# EasyEDA schematic SCH_HackerCard.json
TITLE: Sheet_1; REV: 1.0; Date: 2024-08-17; Sheet: 1/1; Drawn By: linuxdino; Company: Your Company
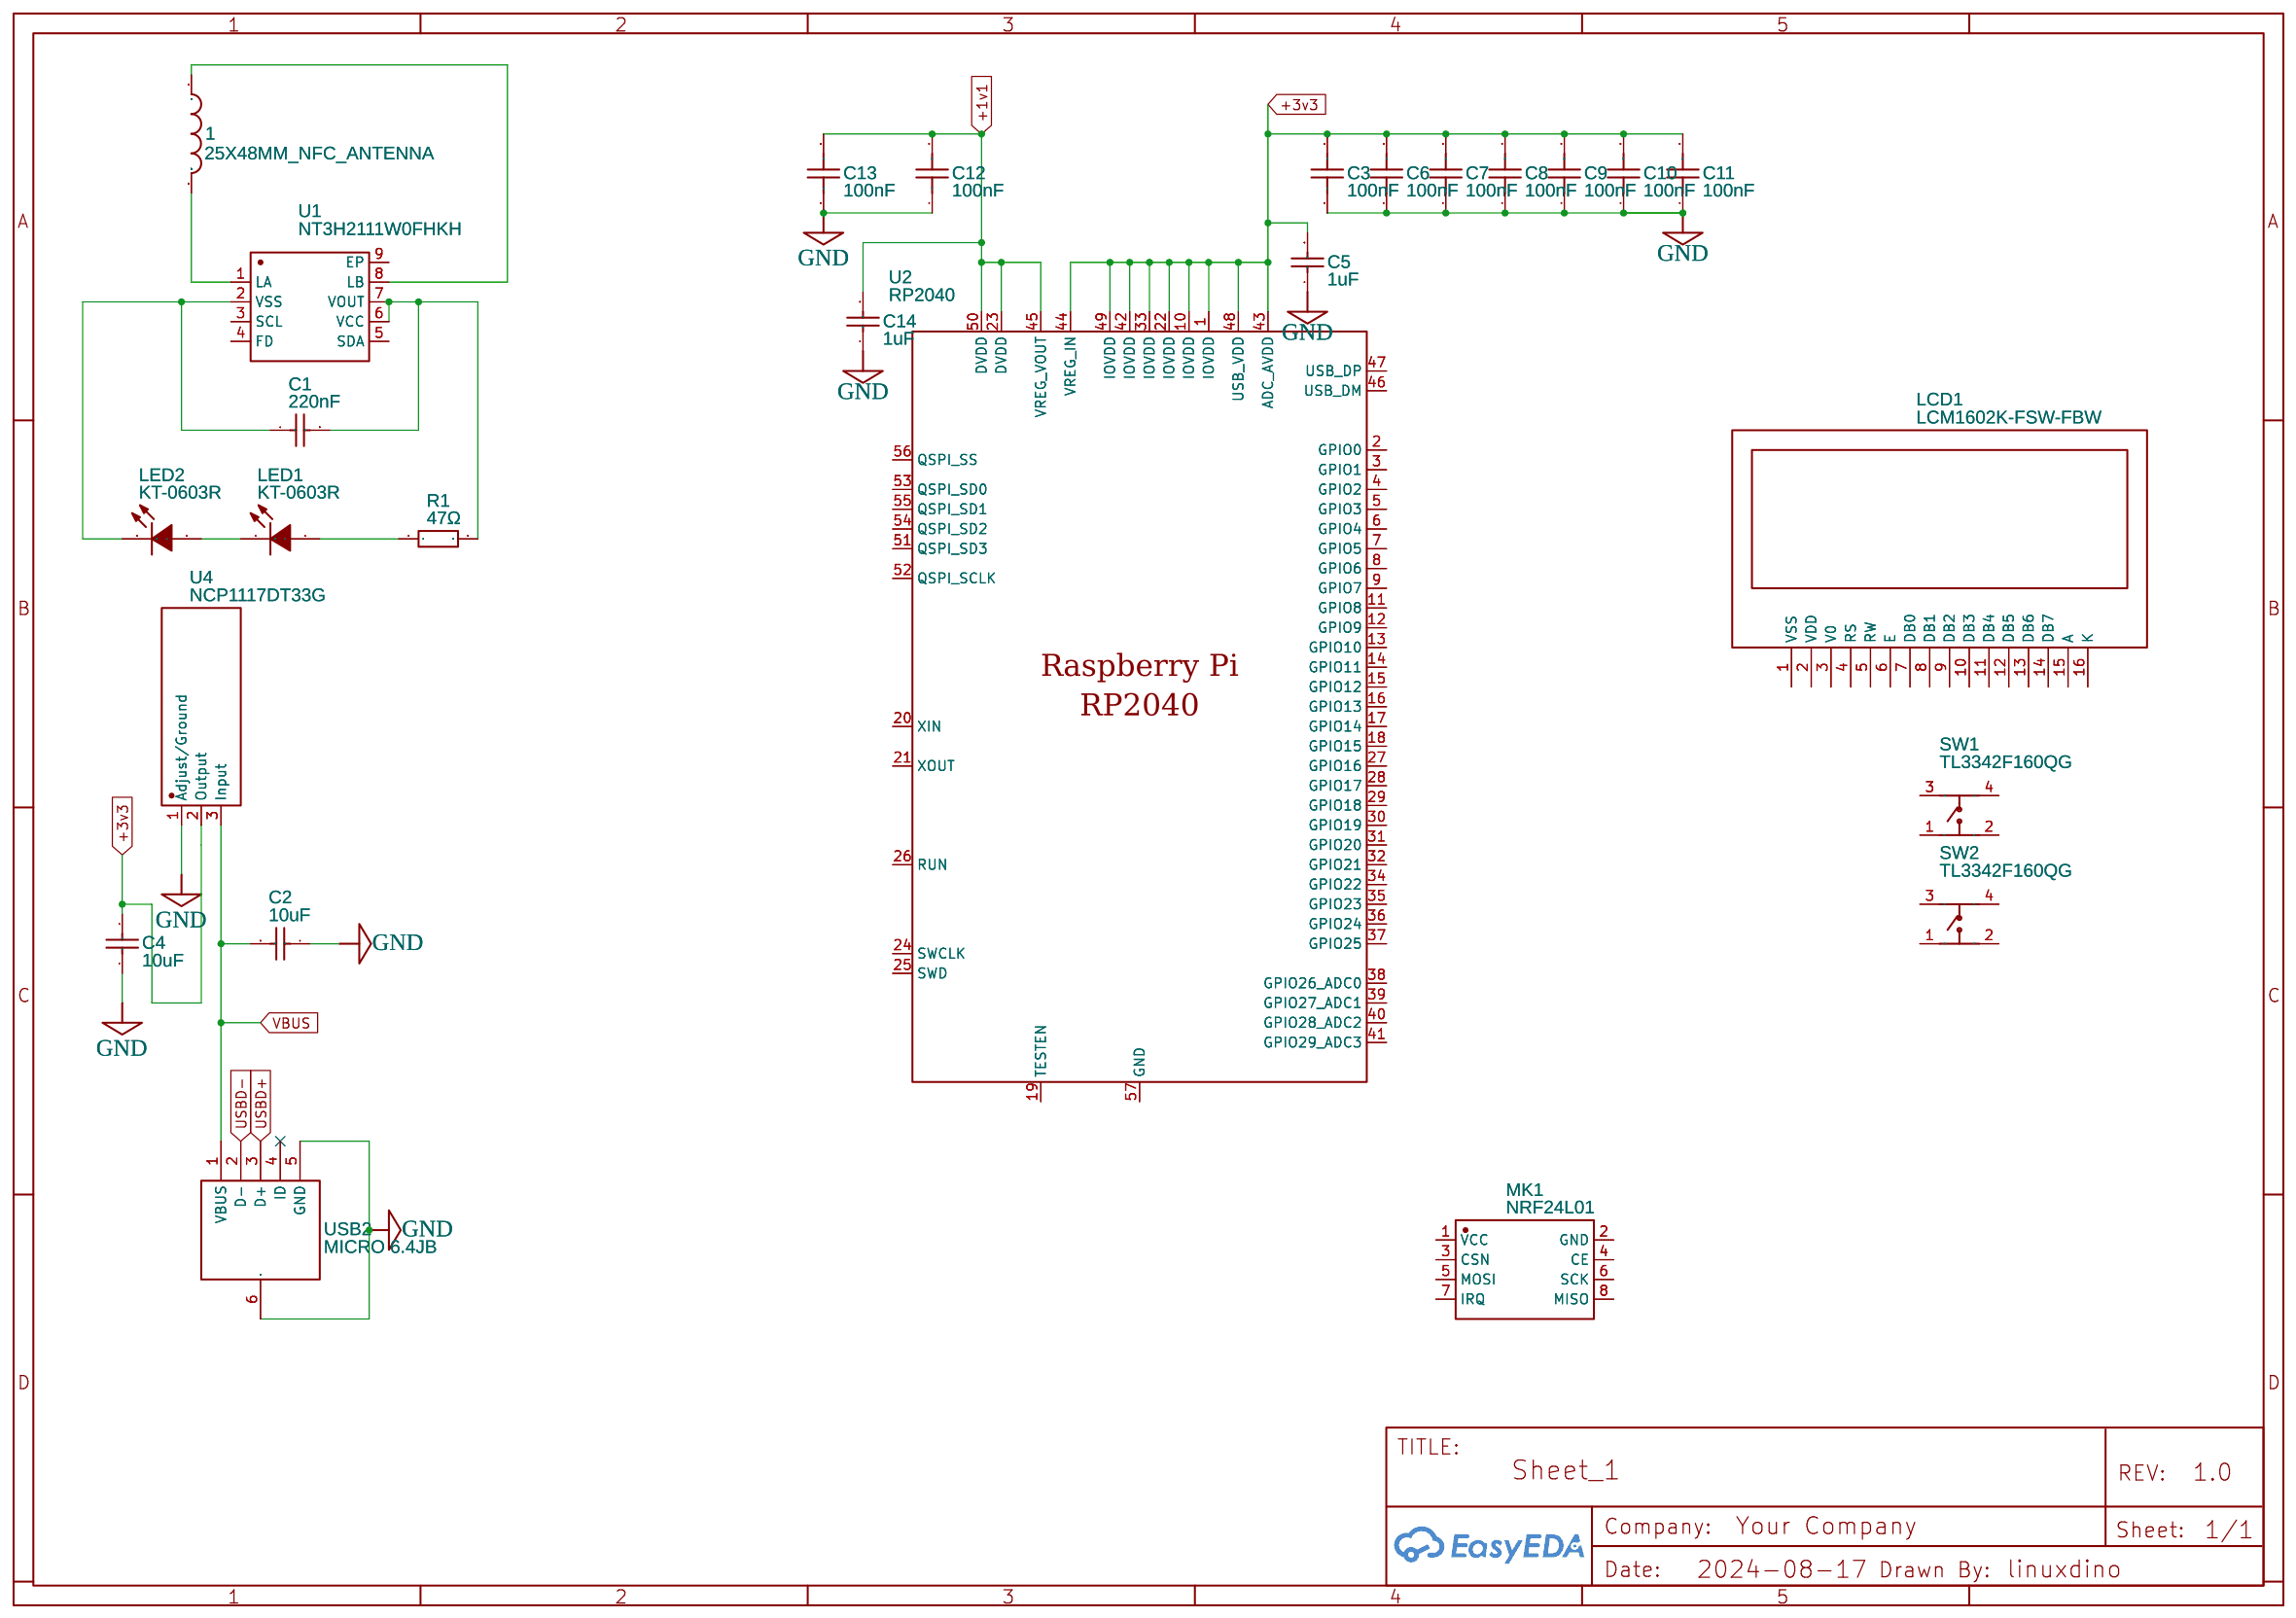
[diagram p0: schematic sheet]

## Parts
1  25X48MM_NFC_ANTENNA  [25X48MM_NFC_ANTENNA]
C1  220nF  [C0603]
C2  10uF  [C1206]
C3  100nF  [C0603]
C4  10uF  [C1206]
C5  1uF  [C0603]
C6  100nF  [C0603]
C7  100nF  [C0603]
C8  100nF  [C0603]
C9  100nF  [C0603]
C10  100nF  [C0603]
C11  100nF  [C0603]
C12  100nF  [C0603]
C13  100nF  [C0603]
C14  1uF  [C0603]
LCD1  LCM1602K-FSW-FBW  [MODULE-TH_LCM1602K]
LED1  KT-0603R  [LED0603-RD]
LED2  KT-0603R  [LED0603-RD]
MK1  NRF24L01  [WIRELM-SMD_NRF24L01]
R1  47Ω  [R0603]
SW1  TL3342F160QG  [SW-SMD_4P-L5.2-W5.2-P3.70-LS6.4-BL]
SW2  TL3342F160QG  [SW-SMD_4P-L5.2-W5.2-P3.70-LS6.4-BL]
U1  NT3H2111W0FHKH  [XQFN-8_L1.6-W1.6-P0.50-BL]
U2  RP2040  [LQFN-56_L7.0-W7.0-P0.4-EP]
U4  NCP1117DT33G  [TO-252_L6.5-W6.1-P4.58-LS9.9-BR]
USB2  MICRO 6.4JB  [MICRO-USB-SMD_C2681558]

## Library data of the parts
1 = 25X48MM_NFC_ANTENNA: Contributor: LoneWalkerWolf
C1 = CL10B224KA8NNNC: Supplier: LCSC; Manufacturer: SAMSUNG(三星); Supplier Part: C21120; JLCPCB Part Class: Basic Part
C2 C4 = CL31A106KOHNNNE: Supplier: LCSC; Manufacturer: SAMSUNG(三星); Supplier Part: C1849; JLCPCB Part Class: Extended Part
C3 C6-C13 = CL10B104KB8NNNC: Supplier: LCSC; Manufacturer: SAMSUNG(三星); Supplier Part: C1591; JLCPCB Part Class: Extended Part
C5 C14 = CL10A105KO8NNNC: Supplier: LCSC; Manufacturer: SAMSUNG(三星); Supplier Part: C1592; JLCPCB Part Class: Extended Part
LCD1 = LCM1602K-FSW-FBW: Supplier: LCSC; Manufacturer: LONTECH(厦门龙特); Supplier Part: C83274; JLCPCB Part Class: Extended Part
LED1 LED2 = KT-0603R: Supplier: LCSC; Manufacturer: KENTO; Supplier Part: C2286; JLCPCB Part Class: Basic Part
MK1 = NRF24L01: Supplier: LCSC; Manufacturer: Ai-Thinker(安信可); Manufacturer Part: NF-04; Supplier Part: C90751; JLCPCB Part Class: Extended Part
R1 = 0603WAF470JT5E: Supplier: LCSC; Manufacturer: UNI-ROYAL(厚声); Supplier Part: C23182; JLCPCB Part Class: Basic Part
SW1 SW2 = TL3342F160QG: Contributor: LCSC; Supplier: LCSC; Supplier Part: C2886898; Manufacturer: E-Switch; JLCPCB Part Class: Extended Part
U1 = NT3H2111W0FHKH: Contributor: LCSC; Supplier: LCSC; Supplier Part: C710403; Manufacturer: NXP(恩智浦); JLCPCB Part Class: Extended Part
U2 = RP2040: Contributor: LCSC; Supplier: LCSC; Supplier Part: C2040; Manufacturer: Raspberry Pi(树莓派); JLCPCB Part Class: Extended Part
U4 = NCP1117DT33G: Contributor: lcsc; Supplier: LCSC; Supplier Part: C154606; Manufacturer: onsemi(安森美); JLCPCB Part Class: Extended Part
USB2 = MICRO 6.4JB: Contributor: LCSC; Supplier: LCSC; Supplier Part: C2681558; Manufacturer: SHOU HAN(首韩); JLCPCB Part Class: Extended Part

## Nets
+1v1: C12.2 C13.2 C14.2 U2.23(DVDD) U2.45(VREG_VOUT) U2.50(DVDD)
+3v3: C3.2 C4.2 C5.2 C6.2 C7.2 C8.2 C9.2 C10.2 C11.2 U2.1(IOVDD) U2.10(IOVDD) U2.22(IOVDD) U2.33(IOVDD) U2.42(IOVDD) U2.43(ADC_AVDD) U2.44(VREG_IN) U2.48(USB_VDD) U2.49(IOVDD) U4.2(Output)
GND: C2.1 C3.1 C4.1 C5.1 C6.1 C7.1 C8.1 C9.1 C10.1 C11.1 C12.1 C13.1 C14.1 U4.1(Adjust/Ground) USB2.5(GND) USB2.6(EH)
VBUS: C2.2 U4.3(Input) USB2.1(VBUS)
USBD+: USB2.3(D+)
USBD-: USB2.2(D-)
Net-(1-P$1): 1.P$1 U1.8(LB)
Net-(1-P$2): 1.P$2 U1.1(LA)
Net-(C1-1): C1.1 LED2.1(K) U1.2(VSS)
Net-(C1-2): C1.2 R1.2 U1.6(VCC) U1.7(VOUT)
Net-(LED1-1): LED1.1(K) LED2.2(A)
Net-(LED1-2): LED1.2(A) R1.1

Not connected (* = marked no-connect by the designer): LCD1 1(VSS) 2(VDD) 3(V0) 4(RS) 5(RW) 6(E) 7(DB0) 8(DB1) 9(DB2) 10(DB3) 11(DB4) 12(DB5) 13(DB6) 14(DB7) 15(A) 16(K); MK1 1(VCC) 2(GND) 3(CSN) 4(CE) 5(MOSI) 6(SCK) 7(IRQ) 8(MISO); SW1 1 2 3 4; SW2 1 2 3 4; U1 3(SCL) 4(FD) 5(SDA) 9(EP); U2 2(GPIO0) 3(GPIO1) 4(GPIO2) 5(GPIO3) 6(GPIO4) 7(GPIO5) 8(GPIO6) 9(GPIO7) 11(GPIO8) 12(GPIO9) 13(GPIO10) 14(GPIO11) 15(GPIO12) 16(GPIO13) 17(GPIO14) 18(GPIO15) 19(TESTEN) 20(XIN) 21(XOUT) 24(SWCLK) 25(SWD) 26(RUN) 27(GPIO16) 28(GPIO17) 29(GPIO18) 30(GPIO19) 31(GPIO20) 32(GPIO21) 34(GPIO22) 35(GPIO23) 36(GPIO24) 37(GPIO25) 38(GPIO26_ADC0) 39(GPIO27_ADC1) 40(GPIO28_ADC2) 41(GPIO29_ADC3) 46(USB_DM) 47(USB_DP) 51(QSPI_SD3) 52(QSPI_SCLK) 53(QSPI_SD0) 54(QSPI_SD2) 55(QSPI_SD1) 56(QSPI_SS) 57(GND); USB2 4(ID)*
